# EAGLE design CanKnoten (EAGLE 6.5.0)
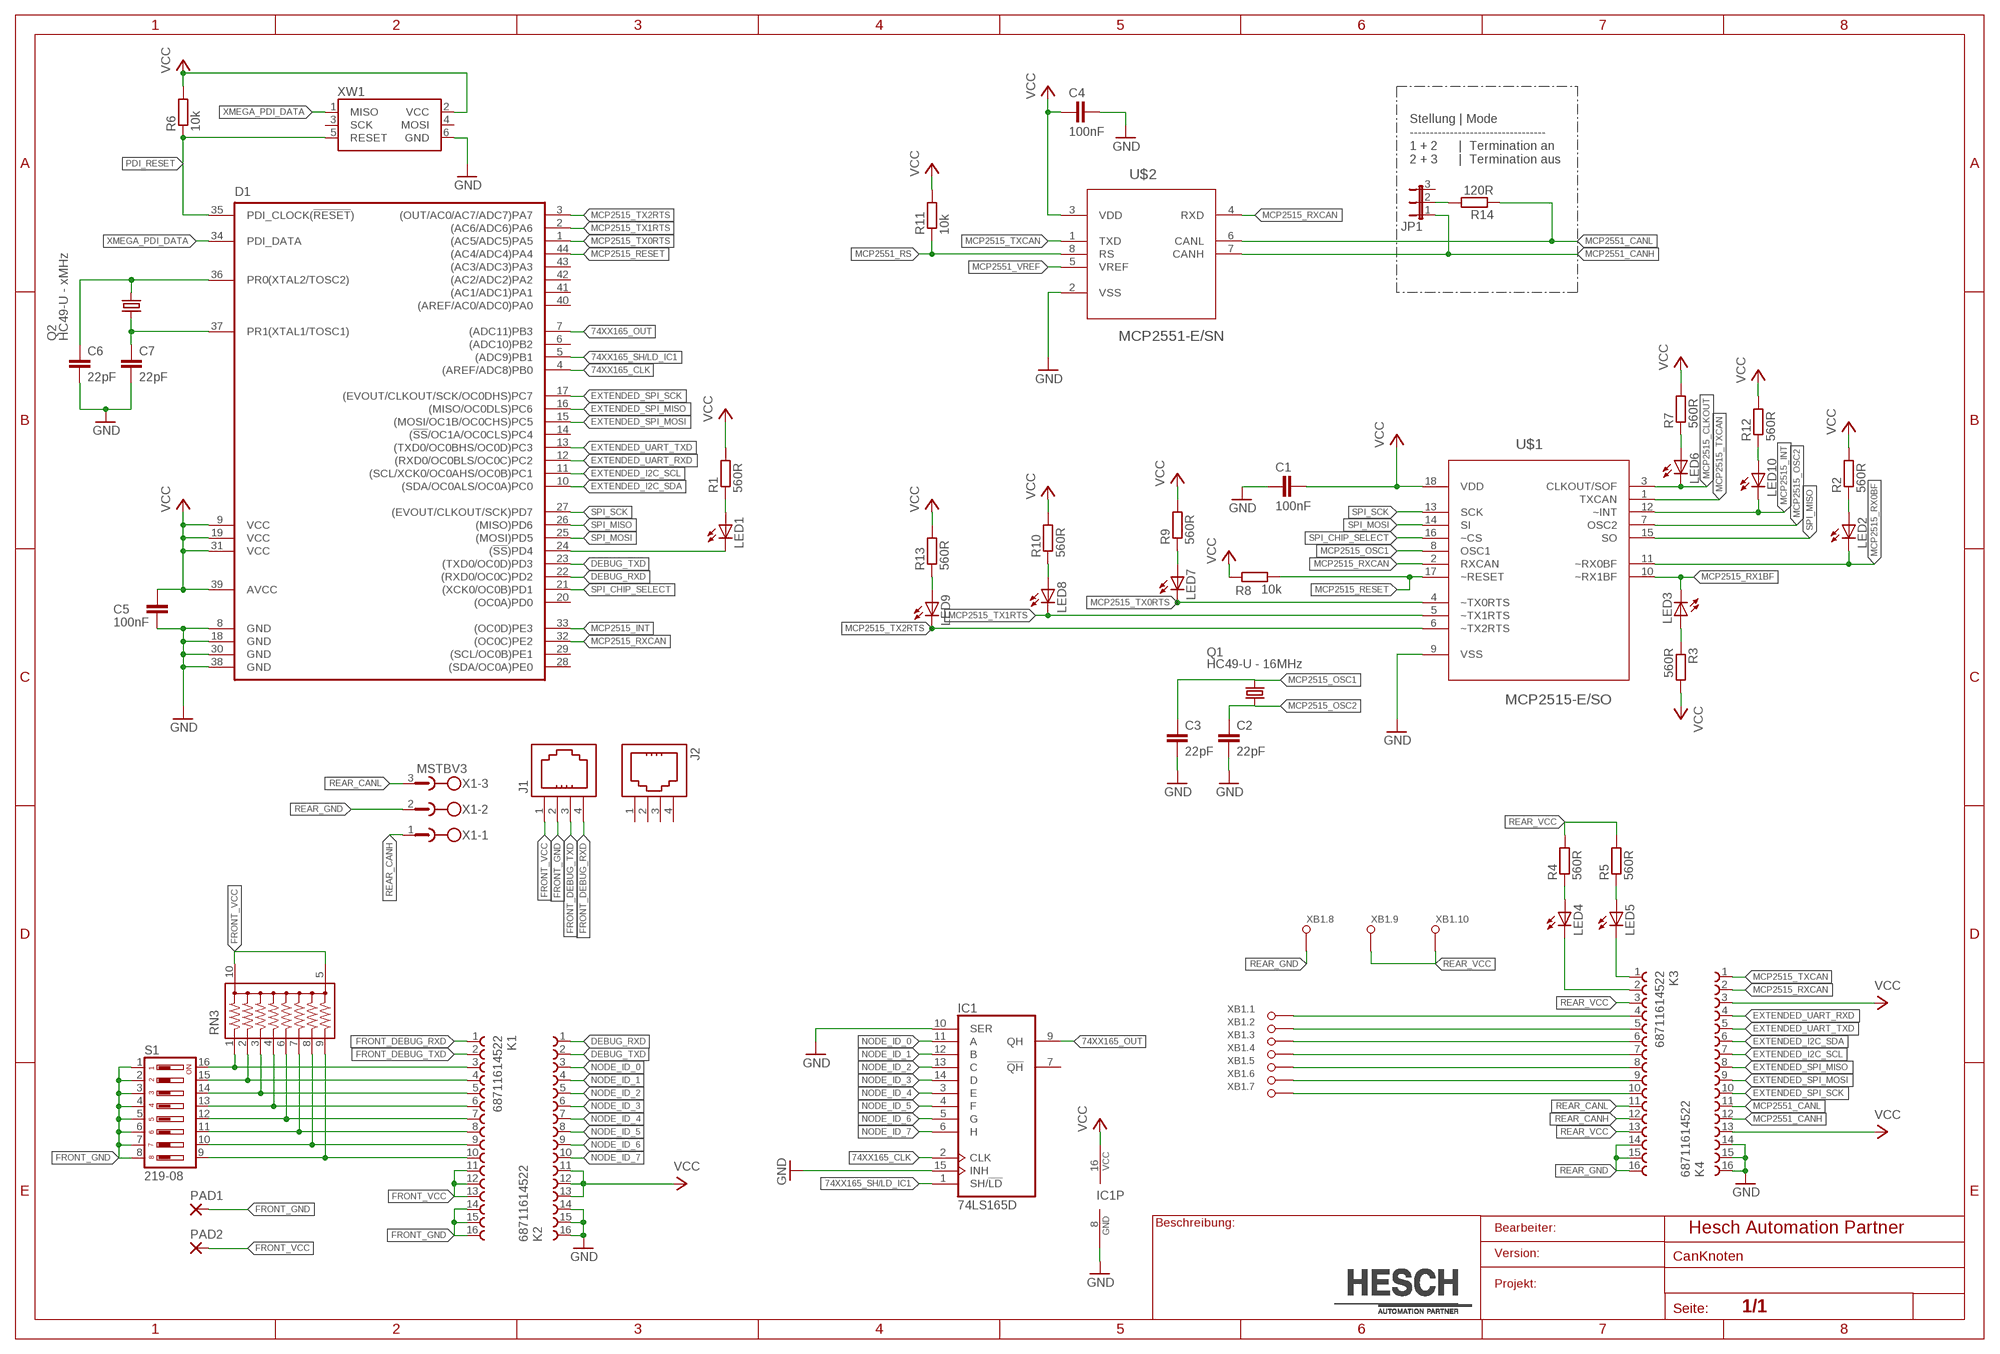
[diagram p0: schematic, sheet 1]

## Parts
C1  100nF  C-EUC1206  [C1206]
C2  22pF  C-EUC1206  [C1206]
C3  22pF  C-EUC1206  [C1206]
C4  100nF  C-EUC1206  [C1206]
C5  100nF  C-EUC1206  [C1206]
C6  22pF  C-EUC1206  [C1206]
C7  22pF  C-EUC1206  [C1206]
D1  ATXMEGA16D4/32D4/64D4/128D4-A  [TQFP44A]
IC1  74LS165D  [SO16]
J1  615004143821  [615004143821]
J2  615004144021  [615004144021]
JP1  JP2E  [JP2]
K1  68711614522  [68711614522]
K2  68711614522  [68711614522]
K3  68711614522  [68711614522]
K4  68711614522  [68711614522]
LED1  LEDSML1206  [SML1206]
LED2  LEDSML1206  [SML1206]
LED3  LEDSML1206  [SML1206]
LED4  LEDSML1206  [SML1206]
LED5  LEDSML1206  [SML1206]
LED6  LEDSML1206  [SML1206]
LED7  LEDSML1206  [SML1206]
LED8  LEDSML1206  [SML1206]
LED9  LEDSML1206  [SML1206]
LED10  LEDSML1206  [SML1206]
PAD1  SMD5  [SMD2,54-5,08]
PAD2  SMD5  [SMD2,54-5,08]
Q1  HC49-U - 16MHz  HC49-U  [HC49]
Q2  HC49-U - xMHz  HC49-U  [HC49]
R1  560R  R-EU_R1206  [R1206]
R2  560R  R-EU_R1206  [R1206]
R3  560R  R-EU_R1206  [R1206]
R4  560R  R-EU_R1206  [R1206]
R5  560R  R-EU_R1206  [R1206]
R6  10k  R-EU_R1206  [R1206]
R7  560R  R-EU_R1206  [R1206]
R8  10k  R-EU_R1206  [R1206]
R9  560R  R-EU_R1206  [R1206]
R10  560R  R-EU_R1206  [R1206]
R11  10k  R-EU_R1206  [R1206]
R12  560R  R-EU_R1206  [R1206]
R13  560R  R-EU_R1206  [R1206]
R14  120R  R-EU_R1206  [R1206]
RN3  745-10  [745-10]
S1  219-08  [CTS-219-08]
U$1  MCP2515-E/SO  [SOIC127P1030X265-18N]
U$2  MCP2551-E/SN  [SOIC127P600X175-8N]
X1  MSTBV3  [MSTBV3]
XB1  WSL10  [WSL10]
XW1  WSL6  [WSL]

## Nets
74XX165_CLK: D1.4((AREF/ADC8)PB0) IC1.2(CLK)
74XX165_OUT: D1.7((ADC11)PB3) IC1.9(QH)
74XX165_SH/LD_IC1: D1.5((ADC9)PB1) IC1.1(SH/!LD)
DEBUG_RXD: D1.22((RXD0/OC0C)PD2) K2.1
DEBUG_TXD: D1.23((TXD0/OC0D)PD3) K2.2
EXTENDED_I2C_SCL: D1.11((SCL/XCK0/OC0AHS/OC0B)PC1) K4.7
EXTENDED_I2C_SDA: D1.10((SDA/OC0ALS/OC0A)PC0) K4.6
EXTENDED_SPI_MISO: D1.16((MISO/OC0DLS)PC6) K4.8
EXTENDED_SPI_MOSI: D1.15((MOSI/OC1B/OC0CHS)PC5) K4.9
EXTENDED_SPI_SCK: D1.17((EVOUT/CLKOUT/SCK/OC0DHS)PC7) K4.10
EXTENDED_UART_RXD: D1.12((RXD0/OC0BLS/OC0C)PC2) K4.4
EXTENDED_UART_TXD: D1.13((TXD0/OC0BHS/OC0D)PC3) K4.5
FRONT_DEBUG_RXD: J1.4 K1.1
FRONT_DEBUG_TXD: J1.3 K1.2
FRONT_GND: J1.2 K1.14 K1.15 K1.16 PAD1.1(P) S1.1 S1.2 S1.3 S1.4 S1.5 S1.6 S1.7 S1.8
FRONT_VCC: J1.1 K1.11 K1.12 K1.13 PAD2.1(P) RN3.5 RN3.10
GND: C1.2 C2.2 C3.2 C4.1 C5.2 C6.2 C7.2 D1.8(GND) D1.18(GND) D1.30(GND) D1.38(GND) IC1.8(GND) IC1.10(SER) IC1.15(INH) K2.14 K2.15 K2.16 K4.14 K4.15 K4.16 U$1.9(VSS) U$2.2(VSS) XW1.6(GND)
MCP2515_CLKOUT: LED6.C U$1.3(CLKOUT/SOF)
MCP2515_INT: D1.33((OC0D)PE3) LED10.C U$1.12(~INT)
MCP2515_OSC1: C3.1 Q1.2 U$1.8(OSC1)
MCP2515_OSC2: C2.1 Q1.1 U$1.7(OSC2)
MCP2515_RESET: D1.44((AC4/ADC4)PA4) R8.1 U$1.17(~RESET)
MCP2515_RX0BF: LED2.C U$1.11(~RX0BF)
MCP2515_RX1BF: LED3.C U$1.10(~RX1BF)
MCP2515_RXCAN: D1.32((OC0C)PE2) K4.2 U$1.2(RXCAN) U$2.4(RXD)
MCP2515_TX0RTS: D1.1((AC5/ADC5)PA5) LED7.C U$1.4(~TX0RTS)
MCP2515_TX1RTS: D1.2((AC6/ADC6)PA6) LED8.C U$1.5(~TX1RTS)
MCP2515_TX2RTS: D1.3((OUT/AC0/AC7/ADC7)PA7) LED9.C U$1.6(~TX2RTS)
MCP2515_TXCAN: K4.1 U$1.1(TXCAN) U$2.1(TXD)
MCP2551_CANH: JP1.1 K4.12 U$2.7(CANH)
MCP2551_CANL: K4.11 R14.1 U$2.6(CANL)
MCP2551_RS: R11.1 U$2.8(RS)
MCP2551_VREF: U$2.5(VREF)
N$1: LED2.A R2.1
N$2: K3.4 XB1.1
N$3: LED3.A R3.1
N$4: K3.5 XB1.2
N$5: K3.6 XB1.3
N$6: K3.7 XB1.4
N$7: K3.8 XB1.5
N$8: K3.9 XB1.6
N$9: K3.10 XB1.7
N$11: LED10.A R12.1
N$12: JP1.2 R14.2
N$13: LED6.A R7.1
N$14: LED7.A R9.1
N$15: C6.1 D1.36(PR0(XTAL2/TOSC2)) Q2.2
N$16: C7.1 D1.37(PR1(XTAL1/TOSC1)) Q2.1
N$17: LED8.A R10.1
N$18: LED9.A R13.1
N$22: K1.3 RN3.1 S1.16
N$23: K1.4 RN3.2 S1.15
N$24: K1.5 RN3.3 S1.14
N$25: K1.6 RN3.4 S1.13
N$26: K1.7 RN3.6 S1.12
N$27: K1.8 RN3.7 S1.11
N$28: K1.9 RN3.8 S1.10
N$29: K1.10 RN3.9 S1.9
N$32: LED1.A R1.1
N$35: LED4.A R4.1
N$36: LED5.A R5.1
NODE_ID_0: IC1.11(A) K2.3
NODE_ID_1: IC1.12(B) K2.4
NODE_ID_2: IC1.13(C) K2.5
NODE_ID_3: IC1.14(D) K2.6
NODE_ID_4: IC1.3(E) K2.7
NODE_ID_5: IC1.4(F) K2.8
NODE_ID_6: IC1.5(G) K2.9
NODE_ID_7: IC1.6(H) K2.10
PDI_RESET: D1.35(PDI_CLOCK(!RESET!)) R6.1 XW1.5(RESET)
REAR_CANH: K3.12 X1.1
REAR_CANL: K3.11 X1.3
REAR_GND: K3.14 K3.15 K3.16 X1.2 XB1.8
REAR_MCP2515_RXCAN: K3.2 LED4.C
REAR_MCP2515_TXCAN: K3.1 LED5.C
REAR_VCC: K3.3 K3.13 R4.2 R5.2 XB1.9 XB1.10
SPI_CHIP_SELECT: D1.21((XCK0/OC0B)PD1) U$1.16(~CS)
SPI_MISO: D1.26((MISO)PD6) U$1.15(SO)
SPI_MOSI: D1.25((MOSI)PD5) U$1.14(SI)
SPI_SCK: D1.27((EVOUT/CLKOUT/SCK)PD7) U$1.13(SCK)
SPI_SLAVE_SELECT_HW: D1.24((!SS!)PD4) LED1.C
VCC: C1.1 C4.2 C5.1 D1.9(VCC) D1.19(VCC) D1.31(VCC) D1.39(AVCC) IC1.16(VCC) K2.11 K2.12 K2.13 K4.3 K4.13 R1.2 R2.2 R3.2 R6.2 R7.2 R8.2 R9.2 R10.2 R11.2 R12.2 R13.2 U$1.18(VDD) U$2.3(VDD) XW1.2(VCC)
XMEGA_PDI_DATA: D1.34(PDI_DATA) XW1.1(MISO)
Unconnected: D1.6((ADC10)PB2) D1.14((!SS!/OC1A/OC0CLS)PC4) D1.20((OC0A)PD0) D1.28((SDA/OC0A)PE0) D1.29((SCL/OC0B)PE1) D1.40((AREF/AC0/ADC0)PA0) D1.41((AC1/ADC1)PA1) D1.42((AC2/ADC2)PA2) D1.43((AC3/ADC3)PA3) IC1.7(!QH) J2.1 J2.2 J2.3 J2.4 JP1.3 XW1.3(SCK) XW1.4(MOSI)

## Notes on the sheet
- Stellung | Mode
  ----------------------------------
  1 + 2      |  Termination an
  2 + 3      |  Termination aus

## Library data of the parts
C1-C7 = rcl:C-EU: CAPACITOR, European symbol
D1 = AVR - XMEGA:ATXMEGA16D4/32D4/64D4/128D4-: Name des Bauteiles: -->ATxmega32D4-AU Daten:SMD-Microcontroller 8/16 Bit Artikelnummer:#045426 Datenblatt:Siehe Hesch Suche ! __________________________________________ generated by Eagle Description Tool am : 14.02.2017 11:35:40 erstellt von: Hm
IC1 = 74xx-us:74*165: 8-bit parallel load SHIFT REGISTER
J1 = InputOutputIO (rev18b):615004143821: WR-MJ Horizontal Plastic 4P4C Modular Jack Tab Up, 4 Pins=>Code : Con_I-O_MJ-H_Plastic_Up_615004143821 <http://katalog.we-online.de/media/images/eican/Con_I-O_MJ-H_Plastic_Up_615004143821_pf2.jpg> Details see: http://katalog.we-online.de/en/em/MJ_HORIZONTAL_PLASTIC_4P4C_TAB_UP Created 2014-07-10, Karrer Zheng 2014 (C) Würth Elektronik
J2 = InputOutputIO (rev18b):615004144021: WR-MJ Vertical Plastic 4P4C Modular Jack With Ears, 4 pins=>Code : Con_I-O_MJ-V_Plastic_615004144021 <http://katalog.we-online.de/media/images/eican/Con_I-O_MJ-V_Plastic_615004144021_pf2.jpg> Details see: http://katalog.we-online.de/en/em/MJ_VERTICAL_PLASTIC_4P4C_W_EARS Created 2014-07-10, Karrer Zheng 2014 (C) Würth Elektronik
JP1 = jumper:JP2E: JUMPER
K1-K4 = Wurth_FPC_FFC:68711614522: WE-FPC 0.5mm SMT ZIF Horizontal Bottom Contact, 16 Pins=>Code : Con_FPC_ZIF_0.50_68711614522 <http://katalog.we-online.de/media/images/eican/Con_FPC_ZIF_0.50_6871xx14522_pf2.jpg> Details see: http://katalog.we-online.de/en/em/687_1xx_145_22 Created 2014-07-09, Karrer Zheng 2014 (C) Würth Elektronik
LED1-LED10 = led:LED: LED OSRAM: - CHIPLED LG R971, LG N971, LY N971, LG Q971, LY Q971, LO R971, LY R971 LH N974, LH R974 LS Q976, LO Q976, LY Q976 LO Q996 - Hyper CHIPLED LW Q18S LB Q993, LB Q99A, LB R99A - SideLED LS A670, LO A670, LY A670, LG A670, LP A670 LB A673, LV A673, LT A673, LW A673 LH A674 LY A675 LS A676, LA A676, LO A676, LY A676, LW A676 LS A679, LY A679, LG A679 - Hyper Micro SIDELED® LS Y876, LA Y876, LO Y876, LY Y876 LT Y87S - SmartLED LW L88C, LW L88S LB L89C, LB L89S, LG L890 LS L89K, LO L89K, LY L89K LS L896, LA L896, LO L896, LY L896 - TOPLED LS T670, LO T670, LY T670, LG T670, LP T670 LSG T670, LSP T670, LSY T670, LOP T670, LYG T670 LG T671, LOG T671, LSG T671 LB T673, LV T673, LT T673, LW T673 LH T674 LS T676, LA T676, LO T676, LY T676, LB T676, LH T676, LSB T676, LW T676 LB T67C, LV T67C, LT T67C, LS T67K, LO T67K, LY T67K, LW E67C LS E67B, LA E67B, LO E67B, LY E67B, LB E67C, LV E67C, LT E67C LW T67C LS T679, LY T679, LG T679 LS T770, LO T770, LY T770, LG T770, LP T770 LB T773, LV T773, LT T773, LW T773 LH T774 LS E675, LA E675, LY E675, LS T675 LS T776, LA T776, LO T776, LY T776, LB T776 LHGB T686 LT T68C, LB T68C - Hyper Mini TOPLED® LB M676 - Mini TOPLED Santana® LG M470 LS M47K, LO M47K, LY M47K Source: http://www.osram.convergy.de LUXEON: - LUMILED® LXK2-PW12-R00, LXK2-PW12-S00, LXK2-PW14-U00, LXK2-PW14-V00 LXK2-PM12-R00, LXK2-PM12-S00, LXK2-PM14-U00 LXK2-PE12-Q00, LXK2-PE12-R00, LXK2-PE12-S00, LXK2-PE14-T00, LXK2-PE14-U00 LXK2-PB12-K00, LXK2-PB12-L00, LXK2-PB12-M00, LXK2-PB14-N00, LXK2-PB14-P00, LXK2-PB14-Q00 LXK2-PR12-L00, LXK2-PR12-M00, LXK2-PR14-Q00, LXK2-PR14-R00 LXK2-PD12-Q00, LXK2-PD12-R00, LXK2-PD12-S00 LXK2-PH12-R00, LXK2-PH12-S00 LXK2-PL12-P00, LXK2-PL12-Q00, LXK2-PL12-R00 Source: www.luxeon.com KINGBRIGHT: KA-3528ASYC Source: www.kingbright.com
PAD1 PAD2 = wirepad:SMD5: SMD PAD
Q1 Q2 = Quarz - HC49UP:HC49: Name des Bauteiles: -->HC49U/P Daten:16 MHz (16000000 Hz) Artikelnummer:#023006 Datenblatt:www.alldatasheet.com __________________________________________ generated by Eagle Description Tool am : 22.01.2014 13:23:52 erstellt von: Hm
R1-R14 = rcl:R-EU_: RESISTOR, European symbol
RN3 = resistor-array:745-10: CTS 745 Series 8 Resistors, 10 Terminations
S1 = switch-dil:219-08*: Surface Mount DIP Switch Series 219 SMT CTS Electronic Components Sourc: www.ctscorp.com; OC_FARNELL: unknown; OC_NEWARK: unknown
U$1 = Microchip_By_element14_Batch_1:MCP2515-E/SO: Stand-Alone CAN Controller; DESCRIPTION: IC CAN CONTROLLER; MPN: MCP2515-E/SO; OC_FARNELL: 1605565; OC_NEWARK: 29H7134; PACKAGE: SOIC-18; SUPPLIER: Microchip
U$2 = Microchip_By_element14_Batch_1:MCP2551-E/SN: High-Speed CAN Transceiver; DESCRIPTION: High-Speed CAN Transceiver; MPN: MCP2551-E/SN; OC_FARNELL: 1467746; OC_NEWARK: 92C4186; PACKAGE: SOIC-8; SUPPLIER: Microchip
X1 = con-phoenix-508:MSTBV3: PHOENIX; MPN: MSTBV 2,5/3-GF-5.08; OC_FARNELL: 1792793; OC_NEWARK: 69R9846
XB1 = Wannenstiftleisten:WSL10
XW1 = Atmel - ISP_6   (AVR ISP MKII):WSL: Name des Bauteiles: Wannenstecker 6 pol. Daten: 6 pol. goldene Kontakte ! Artikelnummer:#131231 Datenblatt:www.datasheet.com / www.reichelt.de

## Board
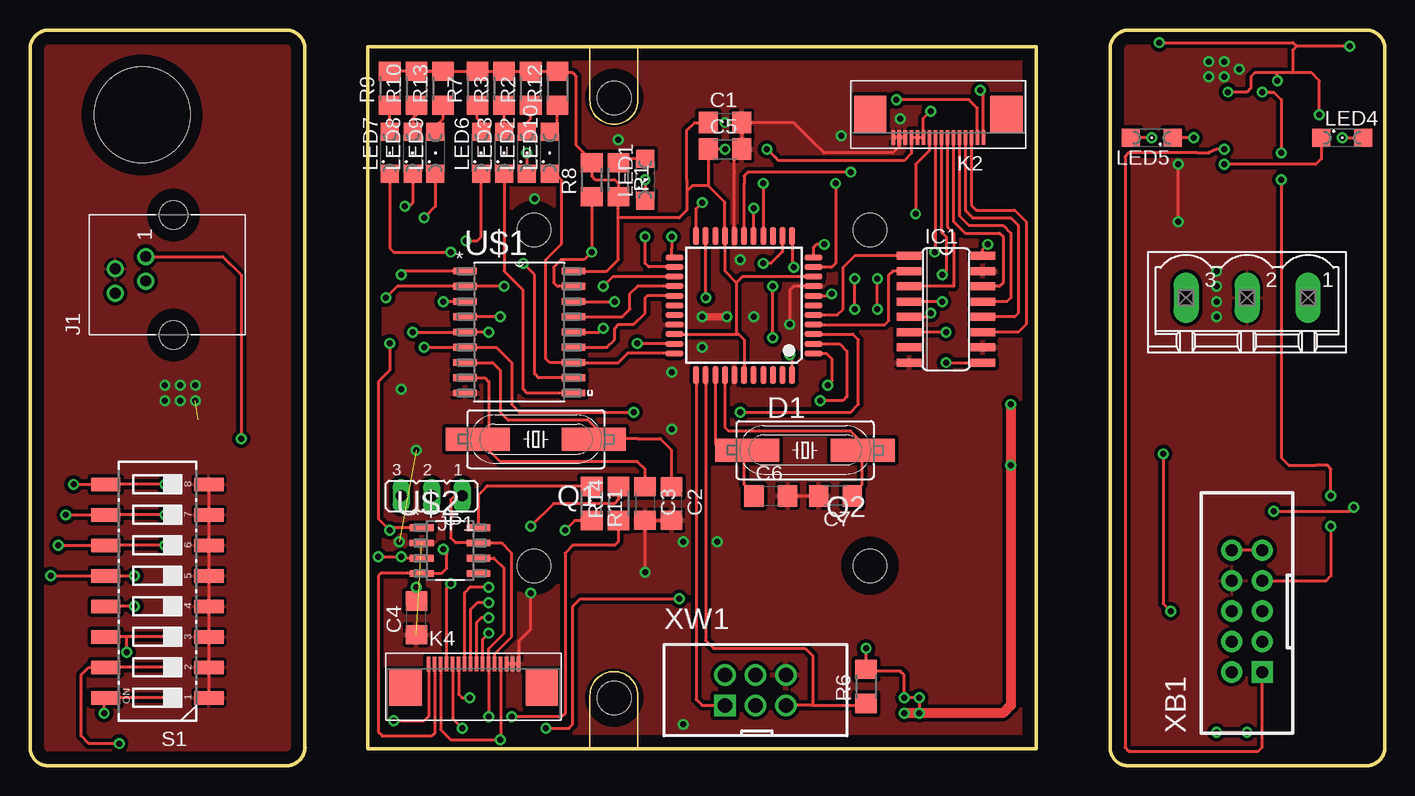
[diagram p1: board, top side]
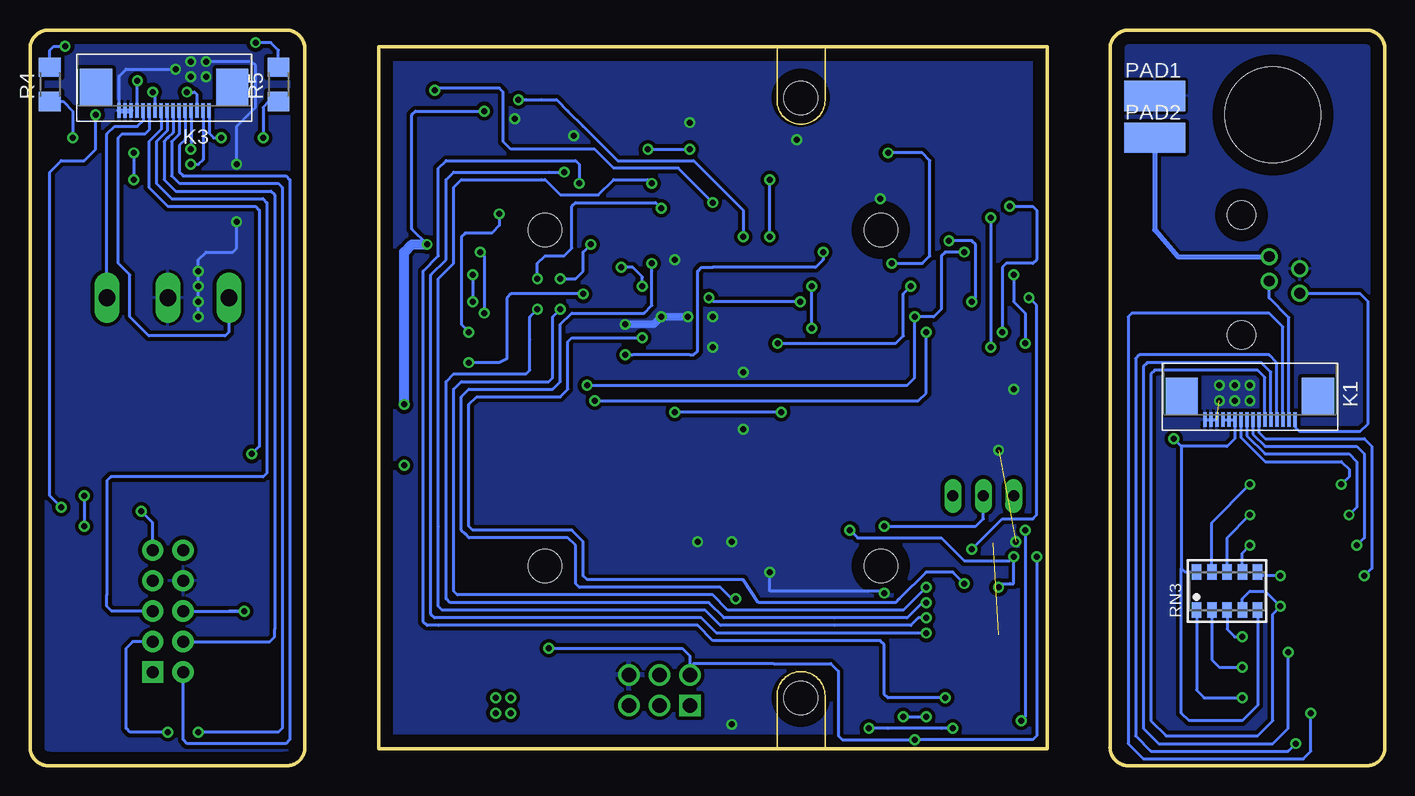
[diagram p2: board, bottom side, seen from below]

Size 112.91 x 61.32 mm. Coordinates in mm from the lower left corner, seen from the top.
Copper layers (1*16): Top 0.035mm / dielectric 1.5mm / Bottom 0.035mm
Design rules "default": minimum track width 10mil, minimum drill 24mil, track to track 8mil, track to pad 8mil, pad to pad 8mil, via to via 8mil, smd to smd 8mil, copper to edge 40mil, drill to drill 8mil, minimum pad ring 10mil, minimum via ring 8mil, stop-mask expansion 4mil, vias tented up to drill 0mil, thermal gap 10mil
Holes 8 mm at 9.34,54.25

### Footprints (pad centres in the part's own frame; a part is rotated, then mirrored left to right if it is on the bottom)
C1206 = smd 1.6 x 1.8: 1 -1.4,0; 2 1.4,0
TQFP44A = smd 1.5 x 0.5: 1 -5.8,4; 2 -5.8,3.2; 3 -5.8,2.4; 4 -5.8,1.6; 5 -5.8,0.8; 6 -5.8,0; 7 -5.8,-0.8; 8 -5.8,-1.6; 9 -5.8,-2.4; 10 -5.8,-3.2; 11 -5.8,-4; 23 5.8,-4; 24 5.8,-3.2; 25 5.8,-2.4; 26 5.8,-1.6; 27 5.8,-0.8; 28 5.8,0; 29 5.8,0.8; 30 5.8,1.6; 31 5.8,2.4; 32 5.8,3.2; 33 5.8,4 | smd 0.5 x 1.5: 12 -4,-5.8; 13 -3.2,-5.8; 14 -2.4,-5.8; 15 -1.6,-5.8; 16 -0.8,-5.8; 17 0,-5.8; 18 0.8,-5.8; 19 1.6,-5.8; 20 2.4,-5.8; 21 3.2,-5.8; 22 4,-5.8; 34 4,5.8; 35 3.2,5.8; 36 2.4,5.8; 37 1.6,5.8; 38 0.8,5.8; 39 0,5.8; 40 -0.8,5.8; 41 -1.6,5.8; 42 -2.4,5.8; 43 -3.2,5.8; 44 -4,5.8
SO16 = smd 0.66 x 2.032: 1 -4.445,-3.073; 2 -3.175,-3.073; 3 -1.905,-3.073; 4 -0.635,-3.073; 5 0.635,-3.073; 6 1.905,-3.073; 7 3.175,-3.073; 8 4.445,-3.073; 9 4.445,3.073; 10 3.175,3.073; 11 1.905,3.073; 12 0.635,3.073; 13 -0.635,3.073; 14 -1.905,3.073; 15 -3.175,3.073; 16 -4.445,3.073
615004143821 = drill 0.9: 1 1.53,2.3; 2 0.51,4.84; 3 -0.51,2.3; 4 -1.53,4.84 | hole 2.36: -5,0; 5,0
615004144021 = drill 0.9: 1 -1.905,-1.27; 2 -0.635,1.27; 3 0.635,-1.27; 4 1.905,1.27 | hole 3.25: -3.81,7.62; 3.81,7.62
JP2 = drill 0.914 long: 1 -2.54,0; 2 0,0; 3 2.54,0
68711614522 = smd 0.3 x 1.2: 1 -3.75,0.6; 2 -3.25,0.6; 3 -2.75,0.6; 4 -2.25,0.6; 5 -1.75,0.6; 6 -1.25,0.6; 7 -0.75,0.6; 8 -0.25,0.6; 9 0.25,0.6; 10 0.75,0.6; 11 1.25,0.6; 12 1.75,0.6; 13 2.25,0.6; 14 2.75,0.6; 15 3.25,0.6; 16 3.75,0.6 | smd 2.7 x 3: Z1 -5.68,-1.38; Z2 5.68,-1.38
SML1206 = smd 1.5 x 1.5: A 1.75,0; C -1.75,0
SMD2,54-5,08 = smd 2.54 x 5.08: 1 0,0
HC49 = smd 5.334 x 1.93: 1 -4.826,0; 2 4.826,0
R1206 = smd 1.6 x 1.803: 1 -1.422,0; 2 1.422,0
745-10 = smd 0.8 x 1.3: 1 -2.54,-1.587; 2 -1.27,-1.587; 3 0,-1.587; 4 1.27,-1.587; 5 2.54,-1.587; 6 2.54,1.587; 7 1.27,1.587; 8 0,1.587; 9 -1.27,1.587; 10 -2.54,1.587
CTS-219-08 = smd 1.13 x 2.44: 1 -8.89,-4.3; 2 -6.35,-4.3; 3 -3.81,-4.3; 4 -1.27,-4.3; 5 1.27,-4.3; 6 3.81,-4.3; 7 6.35,-4.3; 8 8.89,-4.3; 9 8.89,4.3; 10 6.35,4.3; 11 3.81,4.3; 12 1.27,4.3; 13 -1.27,4.3; 14 -3.81,4.3; 15 -6.35,4.3; 16 -8.89,4.3
SOIC127P1030X265-18N = smd 1.981 x 0.559: 1 -4.521,5.08; 2 -4.521,3.81; 3 -4.521,2.54; 4 -4.521,1.27; 5 -4.521,0; 6 -4.521,-1.27; 7 -4.521,-2.54; 8 -4.521,-3.81; 9 -4.521,-5.08; 10 4.521,-5.08; 11 4.521,-3.81; 12 4.521,-2.54; 13 4.521,-1.27; 14 4.521,0; 15 4.521,1.27; 16 4.521,2.54; 17 4.521,3.81; 18 4.521,5.08
SOIC127P600X175-8N = smd 1.981 x 0.559: 1 -2.362,1.905; 2 -2.362,0.635; 3 -2.362,-0.635; 4 -2.362,-1.905; 5 2.362,-1.905; 6 2.362,-0.635; 7 2.362,0.635; 8 2.362,1.905
RND_455-00879_X4 = hole 2.8: -14,-13.54; 14,-13.54; -14,14.46; 14,14.46; -25,7.78; 25,7.78
MSTBV3 = drill 1.397 long: 1 -5.08,0; 2 0,0; 3 5.08,0
WSL10 = drill 1 pad 1.778 square: 1 -5.16,-1.27 | drill 1 pad 1.778: 2 -5.16,1.27; 3 -2.62,-1.27; 4 -2.62,1.27; 5 -0.08,-1.27; 6 -0.08,1.27; 7 2.46,-1.27; 8 2.46,1.27; 9 5,-1.27; 10 5,1.27
WSL = drill 1.2 square: 1 -2.54,-1.27 | drill 1.2: 2 -2.54,1.27; 3 0,-1.27; 4 0,1.27; 5 2.54,-1.27; 6 2.54,1.27

### Placement (x,y rotation side)
C1  57.92,53.61 0 top
C2  53.47,21.86 270 top
C3  51.25,21.86 270 top
C4  32.2,12.34 90 top
C5  57.92,51.39 0 top
C6  61.73,22.5 0 top
C7  67.13,22.5 180 top
D1  59.51,38.37 180 top
IC1  76.33,38.05 270 top
J1  11.95,40.91 90 top
J2  -10.66,30.12 90 top  (outside the outline)
JP1  33.47,22.5 180 top
K1  11.25,29.46 180 bottom
K2  75.7,52.98 180 top
K3  101.73,55.2 180 bottom
K4  36.96,7.89 0 top
LED1  51.25,48.85 90 top
LED2  41.41,51.07 90 top
LED3  39.5,51.07 90 top
LED4  109.35,52.34 0 top
LED5  93.48,52.34 180 top
LED6  37.6,51.07 90 top
LED7  29.98,51.07 90 top
LED8  31.88,51.07 90 top
LED9  33.79,51.07 90 top
LED10  43.31,51.07 90 top
PAD1  19.18,55.83 270 bottom
PAD2  19.18,52.34 270 bottom
Q1  42.16,27.21 180 top
Q2  64.59,26.3 180 top
R1  49.03,48.85 270 top
R2  41.73,56.47 90 top
R3  39.5,56.47 90 top
R4  111.26,56.79 90 bottom
R5  92.21,56.79 90 bottom
R6  69.67,6.62 90 top
R7  37.28,56.47 90 top
R8  46.81,48.85 90 top
R9  29.98,56.47 90 top
R10  32.2,56.47 90 top
R11  46.81,21.86 270 top
R12  43.95,56.47 90 top
R13  34.42,56.47 90 top
R14  49.03,21.86 90 top
RN3  13.15,14.56 0 bottom
S1  10.61,14.56 90 top
U$1  40.77,36.15 0 top
U$2  35.01,17.94 0 top
U$3  [RND_455-00879_X4]  56.46,30.66 90 top
U$4  [25X25_BEST]  76.65,12.34 100 top
X1  101.42,39.01 180 top
XB1  101.42,12.97 90 top
XW1  60.46,6.3 0 top

### Tracks (layer width: path | path; a pad name or v marks a point on that pad's centre or on a via)
74XX165_CLK
  Top 0.254: D1.4 71.24,36.77 71.57,37.1 71.57,40.91 71.89,41.23 IC1.2
74XX165_OUT  (via drill 0.5)
  Top 0.254: v76.34,33.61 IC1.9 | D1.7 66.66,39.17 v66.81,39.32
  Bottom 0.254: v76.34,33.61 73.79,33.61 73.16,33.93 73.16,39.01 72.84,39.32 v66.81,39.32
74XX165_SH/LD_IC1
  Top 0.254: D1.5 67.28,37.57 67.76,38.05 67.76,41.55 68.71,42.5 IC1.1
DEBUG_RXD  (via drill 0.5)
  Top 0.254: K2.1 79.45,56.05 v79.19,56.31 | D1.22 55.51,46.44 v56.01,46.94
  Bottom 0.254: v56.01,46.94 58.87,49.8 64.27,49.8 65.86,51.39 72.84,51.39 73.48,52.02 73.48,56.15 73.79,56.47 79.03,56.47 | 79.03,56.47 v79.19,56.31 79.03,56.47
DEBUG_TXD  (via drill 0.5)
  Top 0.254: K2.2 78.95,54.8 78.24,55.52 v72.21,55.52 | v53.48,44.09 53.48,43.13 53.48,42.5 53.6,42.37 D1.23
  Bottom 0.254: v72.21,55.52 71.57,55.52 70.3,55.52 69.03,55.52 68.08,54.56 66.81,53.29 63.95,50.44 57.6,50.44 53.48,46.31 v53.48,44.09
EXTENDED_I2C_SCL  (via drill 0.5)
  Top 0.254: K4.7 36.21,14.44 36.65,14.88 v38.24,14.88 | v68.71,38.05 v68.71,40.59 | D1.11 65.31,43.22 65.54,43.45 v66.17,43.45
  Bottom 0.254: v38.24,14.88 40.14,12.97 45.86,12.97 54.75,12.97 56.01,14.24 | 56.01,14.24 77.29,14.24 | 77.29,14.24 77.61,14.56 | 56.01,14.24 77.29,14.24 | 77.29,14.24 77.61,14.56 | 77.61,14.56 77.61,31.39 76.97,32.02 69.67,32.02 69.35,32.34 69.35,37.42 v68.71,38.05 | v68.71,40.59 67.45,40.59 66.81,41.23 66.81,42.82 v66.17,43.45
EXTENDED_I2C_SDA  (via drill 0.5)
  Top 0.254: K4.6 35.71,5.97 36.01,5.67 v36.65,5.67 | v67.13,48.53 67.13,41.86 66.81,41.55 65.33,41.55 D1.10
  Bottom 0.254: v36.65,5.67 41.41,5.67 41.73,5.98 41.73,10.11 42.04,10.43 45.86,10.43 56.01,10.43 57.28,11.7 78.87,11.7 79.83,11.7 80.15,12.02 80.15,41.23 78.87,42.5 78.87,49.8 78.24,50.44 67.45,50.44 67.13,50.12 v67.13,48.53
EXTENDED_SPI_MISO  (via drill 0.5)
  Top 0.254: K4.8 36.71,13.04 37.28,13.61 v38.24,13.61 | v70.62,38.05 v70.62,40.59 | D1.16 v60.31,46.46 v60.3,46.47
  Bottom 0.254: v38.24,13.61 38.55,13.61 39.82,12.34 45.86,12.34 55.06,12.34 56.33,13.61 | 56.33,13.61 77.92,13.61 | 77.92,13.61 78.24,13.92 | 56.33,13.61 77.92,13.61 | 77.92,13.61 78.24,13.92 | 78.24,13.92 78.24,32.02 77.61,32.66 71.57,32.66 71.26,32.97 71.26,35.51 71.26,37.42 v70.62,38.05 | v70.62,40.59 70.62,41.86 69.98,42.5 68.4,42.5 67.76,43.13 67.76,46.62 67.45,46.94 60.78,46.94 v60.3,46.47
EXTENDED_SPI_MOSI  (via drill 0.5)
  Top 0.254: K4.9 37.21,11.95 37.6,12.34 v38.24,12.34 | v61.09,48.53 61.09,44.18 D1.15
  Bottom 0.254: v38.24,12.34 38.87,12.34 39.5,11.7 45.86,11.7 55.38,11.7 56.65,12.97 | 56.65,12.97 78.56,12.97 | 78.56,12.97 78.87,13.29 | 56.65,12.97 78.56,12.97 | 78.56,12.97 78.87,13.29 | 78.87,13.29 78.87,19.96 78.87,40.59 77.61,41.86 77.61,48.21 76.97,48.85 70.3,48.85 69.98,48.85 68.71,47.58 65.54,47.58 64.27,48.85 61.41,48.85 v61.09,48.53
EXTENDED_SPI_SCK  (via drill 0.5)
  Top 0.254: K4.10 37.71,10.55 v38.24,11.07 | v68.4,49.48 61.41,49.48 59.82,49.48 59.51,49.16 59.51,48.53 D1.17
  Bottom 0.254: v38.24,11.07 45.86,11.07 55.7,11.07 56.97,12.34 79.19,12.34 79.51,12.65 79.51,40.91 78.24,42.18 78.24,48.85 77.61,49.48 69.67,49.48 v68.4,49.48
EXTENDED_UART_RXD  (via drill 0.5)
  Top 0.254: K4.4 34.71,14.85 v35.06,15.19 | v61.89,35.67 61.89,38.69 v61.89,39.96 | D1.12 63.51,41.67 v63.64,41.55
  Bottom 0.254: v35.06,15.19 36.01,16.15 38.24,16.15 40.46,13.92 40.78,13.61 52.2,13.61 52.84,14.56 53.48,15.51 66.49,15.51 66.81,15.83 66.81,18.69 67.76,19.64 76.02,19.64 76.34,19.96 76.34,30.12 75.7,30.75 68.71,30.75 68.08,31.39 68.08,35.35 67.76,35.67 v61.89,35.67 | v61.89,39.96 61.89,40.75 62.68,41.55 v63.64,41.55
EXTENDED_UART_TXD  (via drill 0.5)
  Top 0.254: K4.5 35.21,3.93 v36.01,3.13 | v43,3.13 44.9,3.13 45.22,3.45 45.22,13.29 45.86,13.92 v54.11,13.92 | D1.13 62.71,42.84 62.37,42.5 61.73,41.86 v61.09,41.86
  Bottom 0.254: v36.01,3.13 36.96,3.13 41.41,3.13 v43,3.13 | v54.11,13.92 54.43,13.92 55.38,14.88 67.13,14.88 67.45,15.19 67.45,18.37 68.08,19 76.34,19 76.65,19.32 76.97,19.64 76.97,30.75 76.34,31.39 69.35,31.39 68.71,32.02 68.71,36.78 67.76,37.73 61.73,37.73 61.09,38.37 61.09,41.23 v61.09,41.86
FRONT_DEBUG_RXD
  Bottom 0.254: K1.1 7.5,28.28 7.12,27.89 2.04,27.89 1.41,28.53 1.41,38.69 2.09,39.38 J1.4
FRONT_DEBUG_TXD
  Bottom 0.254: K1.2 8,37.35 9.66,39.01 J1.3
FRONT_GND  (via drill 0.5)  (1 unrouted)
  Top 0.254: S1.8 S1.7 S1.6 S1.5 S1.4 S1.3 S1.2 S1.1
  Bottom 0.254: K1.16 K1.15 K1.14
  other vias: 13.79,30.43 13.79,31.7 12.52,31.7 12.52,30.43 11.25,30.43 11.25,31.7
  pour Top (isolate 0.305): 23.63,61.87 23.63,-1 -0.5,-1 -0.5,61.87
  pour Bottom (isolate 0.305): 23.63,61.87 23.63,-1 -0.5,-1 -0.5,61.87
FRONT_VCC  (via drill 0.5)
  Top 0.254: J1.1 16.07,42.44 17.6,40.91 v17.6,27.26
  Bottom 0.254: K1.13 K1.12 K1.11 12.5,27.27 13.15,26.62 16.96,26.62 | 16.96,26.62 v17.6,27.26 | 16.96,26.62 16.96,16.46 | RN3.10 16.64,16.15 16.96,16.46 | RN3.5 10.61,5.03 11.88,3.76 16.33,3.76 16.96,4.4 16.96,16.46
  Bottom 0.406: PAD2.1 19.18,44.66 17.28,42.44 J1.1
GND  (via drill 0.5)  (2 unrouted)
  Top 0.254: K4.16 K4.15 K4.14 40.74,8.49 40.78,8.52 40.78,10.43 41.73,11.38 41.73,13.92 v41.73,14.4 | C6.2 C7.2 | C5.2 C1.2 63.64,53.61 65.22,52.02 66.17,51.07 71.89,51.07 72.45,51.63 K2.15 | D1.18 58.71,46.78 58.71,49.51 58.71,50.78 C5.2 | K2.14 K2.15 | K2.15 K2.16 | v51.25,16.15 51.25,17.42 51.25,17.73 51.25,18.69 C3.2 C2.2 | 59.64,51.07 C5.2 | D1.8 63.65,39.97 63.32,39.64 v63.32,36.78
  Top 0.61: v56.01,37.42 v58.08,37.42
  Bottom 0.254: v41.73,14.4 41.89,14.4 42.04,14.56 51.25,14.56 v51.25,16.15
  Bottom 0.61: v58.08,37.42 v60.3,37.42 60.94,36.78 v63.32,36.78
  other vias: 53.47,28.05 32.2,26.3 54.43,3.45 59.19,42.18 56.01,34.88 53.47,32.81 30.93,31.39 49.03,52.18 42.04,47.26 57.92,53.61 54.43,18.69 57.28,18.69 30.77,18.69 72.52,53.93 67.6,52.5
  pour Top (isolate 0.305): 64.9,1.22 28.07,1.22 28.07,59.96 83.95,59.96 83.95,1.22
  pour Bottom (isolate 0.305): 63,1.22 28.07,1.22 28.07,59.96 83.95,59.96 83.95,1.22
MCP2515_CLKOUT  (via drill 0.5)
  Top 0.254: U$1.3 v34.43,38.69 | 37.44,49.16 LED6.C 37.6,44.09 37.28,43.77 v36.33,43.77
  Bottom 0.254: v34.43,38.69 34.11,39.01 34.11,43.45 34.43,43.77 v36.33,43.77
MCP2515_INT
  Top 0.254: D1.33 49.79,34.37 49.03,33.61 U$1.12 43.32,33.61 43,33.93 43,42.18 44.27,43.45 44.27,48.85 43.79,49.32 LED10.C
MCP2515_OSC1
  Top 0.254: 39.5,27.26 37.92,27.26 | 37.92,27.26 37.38,27.26 Q1.2 39.19,25.35 41.09,25.35 50.62,25.35 51.25,24.72 C3.1 | U$1.8 37.92,32.34 38.24,32.02 38.24,27.58 37.92,27.26
MCP2515_OSC2
  Top 0.254: U$1.7 38.55,33.61 39.19,32.97 39.19,29.48 39.82,28.85 46.49,28.85 47.12,28.21 47.12,27.35 Q1.1 47.03,27.26 50.62,27.26 52.52,27.26 53.48,26.3 C2.1
MCP2515_RESET  (via drill 0.5)
  Top 0.254: R8.1 v46.81,42.82 46.17,42.18 44.27,42.18 43.63,41.55 43.63,40.27 43.95,39.96 U$1.17 | D1.44 63.51,34.05 v63.32,34.24
  Bottom 0.254: v46.81,42.82 46.81,42.18 47.44,41.55 56.01,41.55 56.97,41.55 57.28,41.23 57.28,34.56 57.6,34.24 57.92,34.24 62.68,34.24 v63.32,34.24
MCP2515_RX0BF  (via drill 0.5)
  Top 0.254: U$1.11 42.36,32.34 42.04,32.66 42.04,40.91 v41.09,41.86 | v41.41,51.07 LED2.C
  Bottom 0.254: v41.09,41.86 38.55,41.86 37.92,42.5 37.92,50.44 38.55,51.07 v41.41,51.07
MCP2515_RX1BF
  Top 0.254: U$1.10 41.41,31.07 41.09,31.39 41.09,39.64 39.5,41.23 LED3.C
MCP2515_RXCAN  (via drill 0.5)
  Top 0.254: D1.32 50.62,35.17 v50.62,35.2 | v39.5,39.96 U$1.2 30.61,39.96 v29.66,39.01 | K4.2 33.71,2.73 33.47,2.49 29.35,2.49 29.03,2.81 29.03,15.83 29.23,16.03 U$2.4 34.31,16.03 34.74,16.46 34.74,17.73 v34.43,18.05
  Bottom 0.254: v50.62,35.2 40.78,35.2 40.14,35.83 40.14,39.32 v39.5,39.96 | v34.43,18.05 31.89,20.59 29.35,20.59 29.03,20.91 29.03,38.37 v29.66,39.01
MCP2515_TX0RTS  (via drill 0.5)
  Top 0.254: D1.1 66.37,34.37 66.81,33.93 66.81,32.02 v66.49,31.7 | v39.19,37.42 U$1.4 | LED7.C 29.98,43.13 30.3,42.82 v35.06,42.82
  Bottom 0.254: v66.49,31.7 39.82,31.7 39.19,32.34 v39.19,37.42 37.6,37.42 36.96,38.05 36.96,42.5 36.65,42.82 v35.06,42.82
MCP2515_TX1RTS  (via drill 0.5)
  Top 0.254: D1.2 67.47,35.17 68.08,34.56 68.08,30.75 67.76,30.43 v65.86,30.43 | v38.24,36.15 U$1.5 v31.89,36.15 | LED8.C 31.89,46.94 31.57,46.62 v31.25,46.62
  Bottom 0.254: v65.86,30.43 38.87,30.43 38.24,31.07 v38.24,36.15 | v31.25,46.62 29.35,46.62 29.03,46.31 29.03,42.18 29.35,41.86 31.57,41.86 31.89,41.55 v31.89,36.15
MCP2515_TX2RTS  (via drill 0.5)
  Top 0.254: v50.3,29.48 40.78,29.48 40.14,30.12 40.14,33.61 38.87,34.88 U$1.6 v32.84,34.88 | v59.19,29.48 68.4,29.48 69.03,30.12 69.03,35.51 68.57,35.97 D1.3 | LED9.C 33.79,46.62 v32.84,45.67
  Bottom 0.254: v50.3,29.48 v59.19,29.48 | v32.84,45.67 v32.84,34.88
MCP2515_TXCAN  (via drill 0.5)
  Top 0.254: U$2.1 30.18,19.84 v29.98,19.64 29.03,20.59 29.03,32.02 29.98,32.97 v29.98,35.2 | v30.3,3.76 32.84,3.76 33.21,4.14 K4.1 | U$1.1 31.25,41.23 v30.93,40.91
  Bottom 0.254: v29.98,19.64 29.98,4.08 v30.3,3.76 | v30.93,40.91 30.93,38.69 29.98,37.73 v29.98,35.2
MCP2551_CANH
  Top 0.254: JP1.1 35.38,22.5 35.06,22.18 35.06,19 35.49,18.57 U$2.7 39.3,18.57 40.14,17.73 40.14,10.75 39.19,9.8 38.71,9.32 K4.12
MCP2551_CANL  (via drill 0.5)
  Top 0.254: U$2.6 38.67,17.3 39.5,16.46 39.5,11.07 38.21,9.78 K4.11 38.21,4.1 v38.24,4.08 | R14.1 49.03,18.69 48.71,18.37 45.22,18.37 44.58,17.73 44.58,4.4 44.27,4.08 v40.14,4.08
  Bottom 0.254: v40.14,4.08 v38.24,4.08
MCP2551_RS
  Top 0.254: U$2.8 37.38,22.59 37.92,23.13 38.07,23.28 R11.1
N$1
  Top 0.254: LED2.A 41.41,53.61 41.73,53.93 R2.1
N$2  (via drill 0.5)
  Top 0.254: XB1.1 102.69,1.54 102.37,1.22 91.57,1.22 91.26,1.54 91.26,50.75 91.57,51.07 97.29,51.07 98.24,51.07 98.88,51.39 v99.51,51.39
  Bottom 0.254: K3.4 99.48,52.05 v99.51,51.39
N$3
  Top 0.254: LED3.A R3.1
N$4
  Bottom 0.254: K3.5 99.98,52.19 100.46,51.7 100.46,49.48 100.15,49.16 91.57,49.16 91.26,48.85 91.26,2.18 91.57,1.86 99.83,1.86 100.15,2.18 XB1.2
N$5  (via drill 0.5)
  Top 0.254: v98.88,2.81 v101.42,2.81
  Bottom 0.254: K3.6 100.48,52.64 101.1,52.02 101.1,49.16 100.46,48.53 92.21,48.53 91.89,48.21 91.89,3.13 92.21,2.81 v98.88,2.81 | v101.42,2.81 104.59,2.81 104.91,3.13 104.91,9.8 104.36,10.35 XB1.3
N$6
  Bottom 0.254: K3.7 100.98,52.77 101.42,52.34 101.73,52.02 101.73,48.85 100.78,47.9 92.84,47.9 92.53,47.58 92.53,11.38 92.53,10.75 92.92,10.35 XB1.4
N$7
  Bottom 0.254: K3.8 101.48,52.91 102.37,52.02 102.37,48.53 101.1,47.26 93.48,47.26 93.16,46.94 93.16,24.4 93.48,24.08 106.18,24.08 106.5,23.77 106.5,14.24 106.5,13.29 106.1,12.89 XB1.5
N$8  (via drill 0.5)
  Top 0.254: v94.43,25.99 94.43,13.53 v95.07,12.89
  Bottom 0.254: XB1.6 96.34,12.89 | 96.34,12.89 v95.07,12.89 96.34,12.89 | K3.9 101.98,53.04 103.01,52.02 103.01,48.21 101.42,46.62 94.12,46.62 93.8,46.31 93.8,26.62 v94.43,25.99
N$9  (via drill 0.5)
  Top 0.254: v102.69,56.15 103.32,56.15 103.64,56.15 103.96,55.83 104.28,55.52 v104.28,51.07 | v104.28,48.85 104.28,25.67 104.91,25.04 107.13,25.04 108.09,25.04 108.4,24.72 v108.4,22.5 | v108.4,19.96 108.4,15.83 108.01,15.43 XB1.7
  Bottom 0.254: K3.10 102.48,56.15 v102.69,56.15 | v104.28,51.07 v104.28,48.85 | v108.4,22.5 v108.4,19.96
N$11
  Top 0.254: LED10.A 43.32,52.98 43.95,53.61 R12.1
N$12  (via drill 0.5)
  Top 0.254: R14.2 49.03,22.18 48.71,21.86 43.63,21.86 v41.73,19.96
  Bottom 0.254: JP1.2 33.47,20.59 34.11,19.96 v41.73,19.96
N$13
  Top 0.254: LED6.A 37.6,53.61 37.28,53.93 R7.1
N$14
  Top 0.254: LED7.A R9.1
N$15
  Top 0.254: C6.1 60.33,22.62 59.51,23.45 59.51,26.05 Q2.2 57.6,26.3 57.11,26.8 D1.36
N$16
  Top 0.254: C7.1 68.53,22.62 69.35,23.45 69.35,26.24 Q2.1 69.41,26.88 68.4,27.89 58.24,27.89 57.91,28.22 D1.37
N$17
  Top 0.254: R10.1 32.2,54.25 31.89,53.93 LED8.A
N$18
  Top 0.254: LED9.A 33.79,53.29 34.43,53.93 R13.1
N$22  (via drill 0.5)
  Top 0.254: v11.88,5.67 S1.16 6.17,5.52 v6.17,4.4
  Bottom 0.254: RN3.1 15.69,6.3 15.06,5.67 v11.88,5.67 | v6.17,4.4 6.17,1.22 6.8,0.59 20.14,0.59 21.41,1.86 21.41,37.42 21.09,37.73 9.66,37.73 8.5,36.58 K1.3
N$23  (via drill 0.5)
  Top 0.254: v11.88,8.21 S1.15 4.9,8.21 4.26,7.57 4.26,2.49 4.9,1.86 v7.44,1.86
  Bottom 0.254: RN3.2 14.42,8.84 13.79,8.21 v11.88,8.21 | v7.44,1.86 8.07,1.22 19.5,1.22 20.77,2.49 20.77,33.93 20.46,34.24 9.66,34.24 9,33.59 K1.4
N$24  (via drill 0.5)
  Top 0.254: v11.88,10.75 8.07,10.75 | 8.07,10.75 S1.14 | v8.07,9.48 8.07,10.75
  Bottom 0.254: RN3.3 13.15,11.38 12.52,10.75 v11.88,10.75 | v8.07,9.48 8.07,3.13 9.34,1.86 18.87,1.86 20.14,3.13 20.14,33.29 19.82,33.61 10.29,33.61 9.5,32.81 K1.5
N$25  (via drill 0.5)
  Top 0.254: v8.71,13.29 S1.13
  Bottom 0.254: RN3.4 11.88,13.92 11.25,14.56 9.98,14.56 v8.71,13.29 9.34,12.65 9.34,3.76 10.61,2.49 18.23,2.49 19.5,3.76 19.5,32.66 19.18,32.97 10.61,32.97 10,32.36 K1.6
N$26  (via drill 0.5)
  Top 0.254: v8.71,15.83 S1.12 v1.72,15.83
  Bottom 0.254: v8.71,15.83 10.29,15.83 RN3.6 | K1.7 10.5,27.78 9.98,27.26 1.72,27.26 1.09,26.62 1.09,16.46 v1.72,15.83
N$27  (via drill 0.5)
  Top 0.254: v11.25,18.37 S1.11 v2.36,18.37
  Bottom 0.254: RN3.7 11.88,17.73 v11.25,18.37 | K1.8 11,27.65 9.98,26.62 2.36,26.62 1.72,25.99 1.72,19 v2.36,18.37
N$28  (via drill 0.5)
  Top 0.254: v11.25,20.91 S1.10 v2.99,20.91
  Bottom 0.254: RN3.8 13.15,19 v11.25,20.91 | K1.9 11.5,27.51 9.98,25.99 2.99,25.99 2.36,25.35 2.36,21.54 v2.99,20.91
N$29  (via drill 0.5)
  Top 0.254: v11.25,23.45 S1.9 v3.63,23.45
  Bottom 0.254: RN3.9 14.42,20.27 v11.25,23.45 | K1.10 12,27.38 9.98,25.35 3.63,25.35 2.99,24.72 2.99,24.08 v3.63,23.45
N$32
  Top 0.254: LED1.A 49.36,50.6 R1.1
N$35  (via drill 0.5)
  Top 0.254: v109.36,52.34 LED4.A
  Bottom 0.254: R4.1 110.16,55.36 109.36,54.56 v109.36,52.34
N$36  (via drill 0.5)
  Top 0.254: v93.48,52.34 LED5.A
  Bottom 0.254: R5.1 93,55.36 93.48,54.88 v93.48,52.34
NODE_ID_0
  Top 0.254: K2.3 78.45,46.73 78.87,46.31 82.05,46.31 83,45.36 83,36.78 82.37,36.15 IC1.11
NODE_ID_1
  Top 0.254: K2.4 77.95,46.28 78.56,45.67 81.73,45.67 82.37,45.04 82.37,37.73 82.05,37.42 IC1.12
NODE_ID_2
  Top 0.254: K2.5 77.45,45.83 78.24,45.04 81.1,45.04 81.73,44.4 81.73,39.01 81.42,38.69 IC1.13
NODE_ID_3
  Top 0.254: K2.6 76.95,45.38 77.92,44.4 80.78,44.4 81.1,44.09 81.1,40.27 80.78,39.96 IC1.14
NODE_ID_4
  Top 0.254: K2.7 76.45,44.92 76.97,44.4 76.97,40.27 76.97,39.96 IC1.3
NODE_ID_5  (via drill 0.5)
  Top 0.254: K2.8 75.95,44.47 76.34,44.09 76.34,41.23 v76.02,40.91 | v76.02,38.69 IC1.4
  Bottom 0.254: v76.02,40.91 v76.02,38.69
NODE_ID_6  (via drill 0.5)
  Top 0.254: IC1.5 75.06,37.42 v75.06,37.73 | K2.9 75.45,42.88 v75.38,42.82
  Bottom 0.254: v75.38,42.82 75.06,42.5 v75.06,37.73
NODE_ID_7  (via drill 0.5)
  Top 0.254: v76.34,36.15 IC1.6 | K2.10 74.95,51.27 73.79,50.12 v73.79,45.99
  Bottom 0.254: v76.34,36.15 76.97,36.78 76.97,44.09 76.65,44.4 74.43,44.4 73.79,45.04 v73.79,45.99
PDI_RESET
  Top 0.254: 65.22,5.03 XW1.5 | D1.35 56.31,10.46 56.97,9.8 64.59,9.8 65.22,9.16 65.22,5.35 65.22,5.03 | 65.22,5.03 69.5,5.03 R6.1
REAR_CANH
  Bottom 0.254: X1.1 106.5,52.66 105.86,53.29 103.96,53.29 103.48,53.77 K3.12
REAR_CANL
  Bottom 0.254: X1.3 96.34,36.15 96.65,35.83 103.01,35.83 104.59,37.42 104.59,40.91 105.54,41.86 105.54,52.34 105.23,52.66 103.32,52.66 102.98,53 K3.11
REAR_GND  (via drill 0.5)
  Top 0.254: v95.7,45.36 v95.7,50.12
  Bottom 0.254: v98.88,37.42 v98.88,38.69 v98.88,39.96 v98.88,41.23 98.88,42.18 98.24,42.82 96.02,42.82 95.7,43.13 v95.7,45.36 | K3.16 105.48,57.48 104.91,58.06 v100.78,58.06 | v95.7,50.12 95.7,53.29 94.12,54.88 94.12,58.37 94.43,58.69 v98.24,58.69
  Bottom 0.406: K3.16 K3.14
  other vias: 98.24,57.42 99.51,57.42 99.51,58.69
  pour Top (isolate 0.305): 113.8,62.5 113.8,-1 89.03,-1 89.03,62.5
  pour Bottom (isolate 0.305): 113.8,62.5 113.8,-1 89.03,-1 89.03,62.5
REAR_MCP2515_RXCAN  (via drill 0.5)
  Top 0.254: LED4.C 107.61,50.59 107.13,50.12 v99.51,50.12
  Bottom 0.254: v99.51,50.12 98.88,50.12 98.48,50.51 K3.2
REAR_MCP2515_TXCAN  (via drill 0.5)
  Top 0.254: v96.97,52.34 LED5.C
  Bottom 0.254: K3.1 97.98,52.72 97.61,52.34 v96.97,52.34
REAR_VCC  (via drill 0.5)
  Top 0.254: XB1.9 XB1.10 | v103.64,21.23 105.23,21.23 109.99,21.23 v110.31,21.54 | v107.45,54.25 107.45,57.1 106.81,57.74 105.23,57.74 | 105.23,57.74 103.96,57.74 | 103.96,57.74 102.05,57.74 101.73,57.42 101.73,56.47 101.42,56.15 100.15,56.15 v99.83,56.15 | v109.99,59.96 105.54,59.96 | 105.54,59.96 105.23,59.64 105.23,57.74 | v94.12,60.28 105.23,60.28 105.54,59.96 | v103.96,57.1 103.96,57.74
  Bottom 0.254: XB1.9 102.69,20.27 v103.64,21.23 | v110.31,21.54 111.26,22.5 111.26,49.48 110.31,50.44 108.4,50.44 107.45,51.39 v107.45,54.25 | v99.83,56.15 99.2,56.15 98.98,55.94 K3.3 | R4.2 111.26,59.64 110.94,59.96 v109.99,59.96 | R5.2 92.21,59.64 92.84,60.28 v94.12,60.28 | K3.13 103.98,56.76 v103.96,57.1
SPI_CHIP_SELECT  (via drill 0.5)
  Top 0.254: U$1.16 v48.71,38.69 | v56.33,39.01 56.33,44.15 D1.21
  Bottom 0.254: v48.71,38.69 56.01,38.69 v56.33,39.01
SPI_MISO
  Top 0.254: U$1.15 49.35,37.42 49.98,38.05 49.98,39.32 50.63,39.97 D1.26
SPI_MOSI  (via drill 0.5)
  Top 0.254: U$1.14 47.44,36.15 v47.76,36.47 | 47.76,40.27 v47.76,39.96 48.57,40.77 D1.25
  Bottom 0.254: v47.76,36.47 v47.76,39.96
SPI_SCK
  Top 0.254: U$1.13 48.08,34.88 48.71,35.51 48.71,36.47 49.03,36.78 50.3,36.78 51.25,37.73 51.25,39.01 51.42,39.17 D1.27
SPI_SLAVE_SELECT_HW  (via drill 0.5)
  Top 0.254: D1.24 51.54,41.57 51.25,41.86 v51.25,44.09 | v51.25,48.85 LED1.C
  Bottom 0.254: v51.25,44.09 v51.25,48.85
VCC  (via drill 0.5)
  Top 0.254: IC1.16 79.41,43.03 v79.83,43.45 | 34.21,7.15 K4.3 34.21,3.02 35.06,2.18 v39.19,2.18 39.21,2.2 K4.13 | D1.31 58.87,35.97 | 58.87,35.97 59.05,35.97 59.51,35.51 D1.39 | D1.9 59.37,40.77 58.87,40.27 | 58.87,40.27 58.87,35.97 | 58.87,40.27 57.91,41.24 D1.19 57.91,46.95 57.28,47.58 56.65,48.21 56.52,48.34 | v69.67,9.8 69.67,9.16 R6.2 69.82,7.89 72.53,7.89 72.84,7.57 v72.84,5.67 v74.11,5.67 v74.11,4.4 v72.84,4.4 | U$1.18 48.08,41.23 49.03,42.18 49.03,45.67 | 49.03,45.67 R1.2 49.03,48.53 48.71,48.85 47.12,48.85 46.81,49.16 R8.2 46.81,50.44 45.54,51.7 45.54,57.42 45.22,57.74 43.78,57.74 R12.2 R2.2 R3.2 R7.2 R13.2 | 54.75,47.9 54.75,48.85 54.75,52.98 55.38,53.61 C1.1 56.33,53.8 | 54.75,47.9 54.75,46.31 54.11,45.67 49.03,45.67 | R11.2 45.39,20.44 v44.58,19.64 | v29.03,17.42 v30.93,17.42 31.04,17.3 U$2.3 | 56.52,48.34 C5.1 v57.92,51.39 | 56.52,48.34 55.19,48.34 54.75,47.9 | C4.2 v32.2,14.88 | R10.2 33.15,57.89 | 33.15,57.89 R13.2 | R10.2 33.15,57.89 | R13.2 R10.2 | R10.2 R9.2 | v75.06,54.56 74.45,53.95 K2.11 K2.12 K2.13 73.45,51.04 72.84,50.44 62.37,50.44 62.05,50.75 v61.41,51.39
  Top 0.813: v72.84,4.4 81.1,4.4 81.73,5.03 v81.73,25.04 v81.73,30.12
  Bottom 0.254: v79.83,43.45 81.1,44.72 81.1,54.25 80.78,54.56 v75.06,54.56 | XW1.2 57.92,8.21 | 57.92,8.21 57.92,8.52 57.92,9.16 58.56,9.8 v69.67,9.8 | v29.03,17.42 29.03,2.49 29.35,2.18 38.87,2.18 v39.19,2.18 45.22,2.18 45.54,2.49 45.54,7.89 46.17,8.52 50.93,8.52 57.6,8.52 57.92,8.21 | v44.58,19.64 44.27,19.32 43.95,19 37.6,19 36.96,19 35.38,17.42 35.06,17.1 31.25,17.1 v30.93,17.42 30.93,15.19 31.25,15.19 32.2,15.19 v32.2,14.88 | v61.41,51.39 v57.92,51.39
  Bottom 0.813: v81.73,30.12 81.73,42.82 81.1,43.45 v79.83,43.45
XMEGA_PDI_DATA
  Top 0.254: XW1.1 56.01,5.03 55.51,5.54 D1.34

### Text on the board
Beschriftungen: TxD | RxD | GND | CAN-L | CAN-H